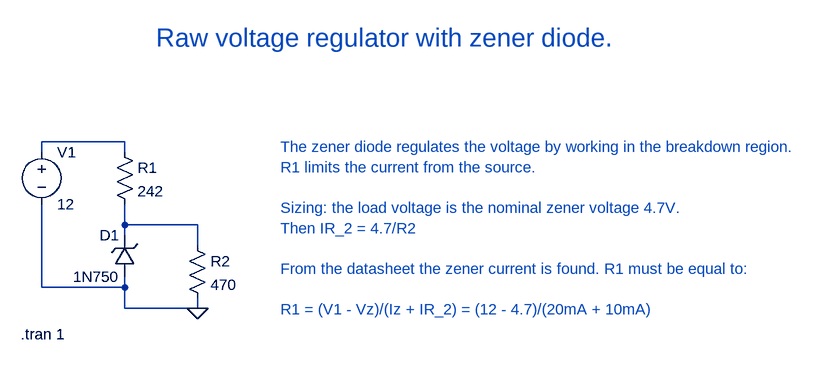
[diagram p0: schematic Raw-voltage-regulator-with-zener-diode.asc]
Raw-voltage-regulator-with-zener-diode.asc, the LTspice schematic file:
Version 4.1
SHEET 1 1392 680
WIRE 112 336 112 352
WIRE 224 368 224 384
WIRE -16 224 -16 240
WIRE 112 352 112 384
WIRE 112 384 224 384
WIRE 112 352 -16 352
WIRE -16 352 -16 240
FLAG 224 384 0
WIRE 112 144 112 128
WIRE -16 144 -16 128
WIRE 112 128 -16 128
WIRE 112 272 112 256
WIRE 112 224 112 240
WIRE 224 288 224 272
WIRE 112 256 112 240
WIRE 112 256 224 256
WIRE 224 256 224 272
SYMBOL zener 128 336 R180
WINDOW 0 24 64 Left 2
WINDOW 3 24 0 Left 2
SYMATTR InstName D1
SYMATTR Value 1N750
SYMBOL res 96 128 R0
SYMATTR InstName R1
SYMATTR Value 242
SYMBOL voltage -16 128 R0
WINDOW 123 0 0 Left 2
WINDOW 39 0 0 Left 2
SYMATTR InstName V1
SYMATTR Value 12
SYMBOL res 208 272 R0
SYMATTR InstName R2
SYMATTR Value 470
TEXT 160 -32 Left 4 ;Raw voltage regulator with zener diode.
TEXT 352 136 Left 2 ;The zener diode regulates the voltage by working in the breakdown region.\nR1 limits the current from the source.\n \nSizing: the load voltage is the nominal zener voltage 4.7V.\nThen IR_2 = 4.7/R2\n \nFrom the datasheet the zener current is found. R1 must be equal to:\n \nR1 = (V1 - Vz)/(Iz + IR_2) = (12 - 4.7)/(20mA + 10mA)
TEXT -48 424 Left 2 !.tran 1

The netlist it stands for:
* Raw-voltage-regulator-with-zener-diode.asc
D1 0 N002 1N750
R1 N001 N002 242
V1 N001 0 12
R2 N002 0 470
.model D D
.lib standard.dio
* Raw voltage regulator with zener diode.
* The zener diode regulates the voltage by working in the breakdown region.
* R1 limits the current from the source.
* Sizing: the load voltage is the nominal zener voltage 4.7V.
* Then IR_2 = 4.7/R2
* From the datasheet the zener current is found. R1 must be equal to:
* R1 = (V1 - Vz)/(Iz + IR_2) = (12 - 4.7)/(20mA + 10mA)
.tran 1
.backanno
.end